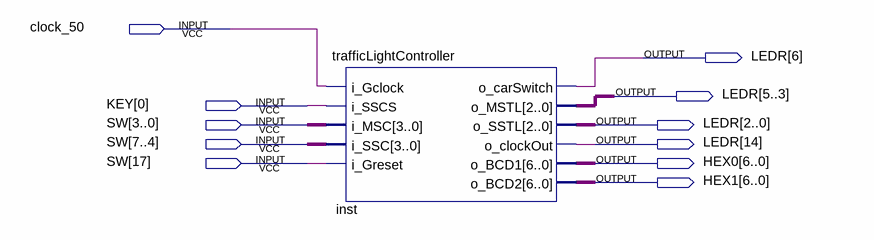
[diagram p0: schematic sheet]
// Quartus schematic topLevel.bdf as structural Verilog: 1 symbols, 11 pins
module topLevel (
  input  clock_50,
  input  [0:0] KEY,
  input  [17:0] SW,
  output [14:0] LEDR,
  output [6:0] HEX0,
  output [6:0] HEX1
);

  trafficLightController inst (
    .i_Gclock(clock_50), .i_SSCS(KEY[0]), .i_MSC(SW[3:0]), .i_SSC(SW[7:4]), .i_Greset(SW[17]),
    .o_carSwitch(LEDR[6]), .o_MSTL(LEDR[5:3]), .o_SSTL(LEDR[2:0]), .o_clockOut(LEDR[14]), .o_BCD1(HEX0),
    .o_BCD2(HEX1));
endmodule
